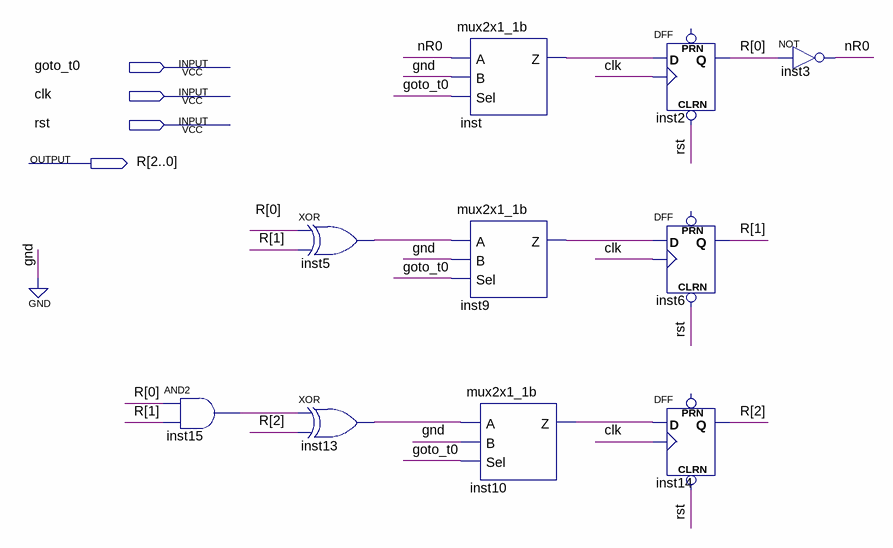
[diagram p0: schematic sheet]
// Quartus schematic contador3b.bdf as structural Verilog: 10 symbols, 4 pins
module contador3b (
  input  goto_t0,
  input  clk,
  input  rst,
  output [2:0] R
);

  wire inst5_out, inst9_z, inst10_z, inst13_out, inst15_out, inst_z, nR0;

  and inst15 (inst15_out, R[0], R[1]);
  xor inst5 (inst5_out, R[0], R[1]);
  xor inst13 (inst13_out, inst15_out, R[2]);
  mux2x1_1b inst (.A(nR0), .B(1'b0), .Sel(goto_t0), .Z(inst_z));
  mux2x1_1b inst9 (.A(inst5_out), .B(1'b0), .Sel(goto_t0), .Z(inst9_z));
  mux2x1_1b inst10 (.A(inst13_out), .B(1'b0), .Sel(goto_t0), .Z(inst10_z));
  DFF inst2 (.CLRN(rst), .CLK(clk), .D(inst_z), .Q(R[0]));  // open: PRN
  DFF inst6 (.CLRN(rst), .CLK(clk), .D(inst9_z), .Q(R[1]));  // open: PRN
  DFF inst14 (.CLRN(rst), .CLK(clk), .D(inst10_z), .Q(R[2]));  // open: PRN
  not inst3 (nR0, R[0]);
endmodule
